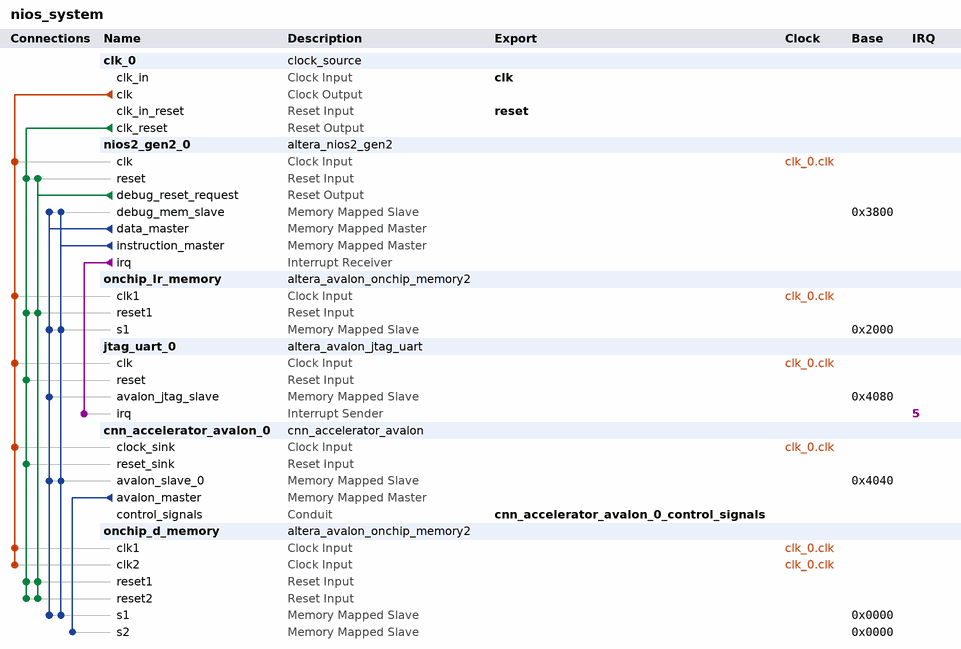
[diagram p0: system contents]
# Platform Designer (Qsys) system nios_system, Cyclone V 5CSEMA4U23C6
# Parameters at their usual value, and those the tool derives, are not listed.
package require -exact qsys 20.1
create_system nios_system
set_project_property DEVICE_FAMILY {Cyclone V}
set_project_property DEVICE 5CSEMA4U23C6

add_instance clk_0 clock_source 20.1
set_instance_parameter_value clk_0 clockFrequency 50000000

add_instance nios2_gen2_0 altera_nios2_gen2 20.1
set_instance_parameter_value nios2_gen2_0 dcache_size 2048
set_instance_parameter_value nios2_gen2_0 exceptionSlave onchip_Ir_memory.s1
set_instance_parameter_value nios2_gen2_0 icache_size 4096
set_instance_parameter_value nios2_gen2_0 impl Tiny
set_instance_parameter_value nios2_gen2_0 resetSlave onchip_Ir_memory.s1
set_instance_parameter_value nios2_gen2_0 resetrequest_enabled false

add_instance onchip_Ir_memory altera_avalon_onchip_memory2 20.1
set_instance_parameter_value onchip_Ir_memory dataWidth 32
set_instance_parameter_value onchip_Ir_memory dualPort false
set_instance_parameter_value onchip_Ir_memory initMemContent true
set_instance_parameter_value onchip_Ir_memory initializationFileName onchip_mem.hex
set_instance_parameter_value onchip_Ir_memory memorySize 4096

add_instance jtag_uart_0 altera_avalon_jtag_uart 20.1
set_instance_parameter_value jtag_uart_0 simInteractiveOptions NO_INTERACTIVE_WINDOWS

add_instance cnn_accelerator_avalon_0 cnn_accelerator_avalon 1.0
set_instance_parameter_value cnn_accelerator_avalon_0 BITWIDTH_DATA_OUT 16
set_instance_parameter_value cnn_accelerator_avalon_0 BITWIDTH_IF_CHANNELS 2
set_instance_parameter_value cnn_accelerator_avalon_0 BITWIDTH_IF_COLUMS 11
set_instance_parameter_value cnn_accelerator_avalon_0 BITWIDTH_IF_ROWS 10
set_instance_parameter_value cnn_accelerator_avalon_0 BITWIDTH_STRIDE 4
set_instance_parameter_value cnn_accelerator_avalon_0 BITWIDTH_W_COLUMS 4
set_instance_parameter_value cnn_accelerator_avalon_0 BITWIDTH_W_ROWS 4
set_instance_parameter_value cnn_accelerator_avalon_0 OFFMEM_ADDR_WIDTH 32
set_instance_parameter_value cnn_accelerator_avalon_0 OFFMEM_DATA_WIDTH 16

add_instance onchip_d_memory altera_avalon_onchip_memory2 20.1
set_instance_parameter_value onchip_d_memory dataWidth 32
set_instance_parameter_value onchip_d_memory dualPort true
set_instance_parameter_value onchip_d_memory initMemContent true
set_instance_parameter_value onchip_d_memory initializationFileName onchip_mem.hex
set_instance_parameter_value onchip_d_memory memorySize 4096

# connections
add_connection clk_0.clk cnn_accelerator_avalon_0.clock_sink clock
add_connection clk_0.clk jtag_uart_0.clk clock
add_connection clk_0.clk nios2_gen2_0.clk clock
add_connection clk_0.clk onchip_d_memory.clk1 clock
add_connection clk_0.clk onchip_d_memory.clk2 clock
add_connection clk_0.clk onchip_Ir_memory.clk1 clock
add_connection clk_0.clk_reset cnn_accelerator_avalon_0.reset_sink reset
add_connection clk_0.clk_reset jtag_uart_0.reset reset
add_connection clk_0.clk_reset nios2_gen2_0.reset reset
add_connection clk_0.clk_reset onchip_d_memory.reset1 reset
add_connection clk_0.clk_reset onchip_d_memory.reset2 reset
add_connection clk_0.clk_reset onchip_Ir_memory.reset1 reset
add_connection nios2_gen2_0.debug_reset_request nios2_gen2_0.reset reset
add_connection nios2_gen2_0.debug_reset_request onchip_d_memory.reset1 reset
add_connection nios2_gen2_0.debug_reset_request onchip_d_memory.reset2 reset
add_connection nios2_gen2_0.debug_reset_request onchip_Ir_memory.reset1 reset
add_connection cnn_accelerator_avalon_0.avalon_master onchip_d_memory.s2 avalon
set_connection_parameter_value cnn_accelerator_avalon_0.avalon_master/onchip_d_memory.s2 baseAddress 0x0000
add_connection nios2_gen2_0.data_master cnn_accelerator_avalon_0.avalon_slave_0 avalon
set_connection_parameter_value nios2_gen2_0.data_master/cnn_accelerator_avalon_0.avalon_slave_0 baseAddress 0x4040
add_connection nios2_gen2_0.data_master jtag_uart_0.avalon_jtag_slave avalon
set_connection_parameter_value nios2_gen2_0.data_master/jtag_uart_0.avalon_jtag_slave baseAddress 0x4080
add_connection nios2_gen2_0.data_master nios2_gen2_0.debug_mem_slave avalon
set_connection_parameter_value nios2_gen2_0.data_master/nios2_gen2_0.debug_mem_slave baseAddress 0x3800
add_connection nios2_gen2_0.data_master onchip_d_memory.s1 avalon
set_connection_parameter_value nios2_gen2_0.data_master/onchip_d_memory.s1 baseAddress 0x0000
add_connection nios2_gen2_0.data_master onchip_Ir_memory.s1 avalon
set_connection_parameter_value nios2_gen2_0.data_master/onchip_Ir_memory.s1 baseAddress 0x2000
add_connection nios2_gen2_0.instruction_master cnn_accelerator_avalon_0.avalon_slave_0 avalon
set_connection_parameter_value nios2_gen2_0.instruction_master/cnn_accelerator_avalon_0.avalon_slave_0 baseAddress 0x4040
add_connection nios2_gen2_0.instruction_master nios2_gen2_0.debug_mem_slave avalon
set_connection_parameter_value nios2_gen2_0.instruction_master/nios2_gen2_0.debug_mem_slave baseAddress 0x3800
add_connection nios2_gen2_0.instruction_master onchip_d_memory.s1 avalon
set_connection_parameter_value nios2_gen2_0.instruction_master/onchip_d_memory.s1 baseAddress 0x0000
add_connection nios2_gen2_0.instruction_master onchip_Ir_memory.s1 avalon
set_connection_parameter_value nios2_gen2_0.instruction_master/onchip_Ir_memory.s1 baseAddress 0x2000
add_connection nios2_gen2_0.irq jtag_uart_0.irq interrupt
set_connection_parameter_value nios2_gen2_0.irq/jtag_uart_0.irq irqNumber 5

# exported interfaces
add_interface clk clock sink
set_interface_property clk EXPORT_OF clk_0.clk_in
add_interface cnn_accelerator_avalon_0_control_signals conduit end
set_interface_property cnn_accelerator_avalon_0_control_signals EXPORT_OF cnn_accelerator_avalon_0.control_signals
add_interface reset reset sink
set_interface_property reset EXPORT_OF clk_0.clk_in_reset

set_interconnect_requirement {$system} qsys_mm.clockCrossingAdapter HANDSHAKE
set_interconnect_requirement {$system} qsys_mm.enableEccProtection FALSE
set_interconnect_requirement {$system} qsys_mm.insertDefaultSlave FALSE
set_interconnect_requirement {$system} qsys_mm.maxAdditionalLatency 1

save_system nios_system.qsys
